# EAGLE design NixieClockControllerWemos (EAGLE 8.2.2)

## Sheet 1 of 2
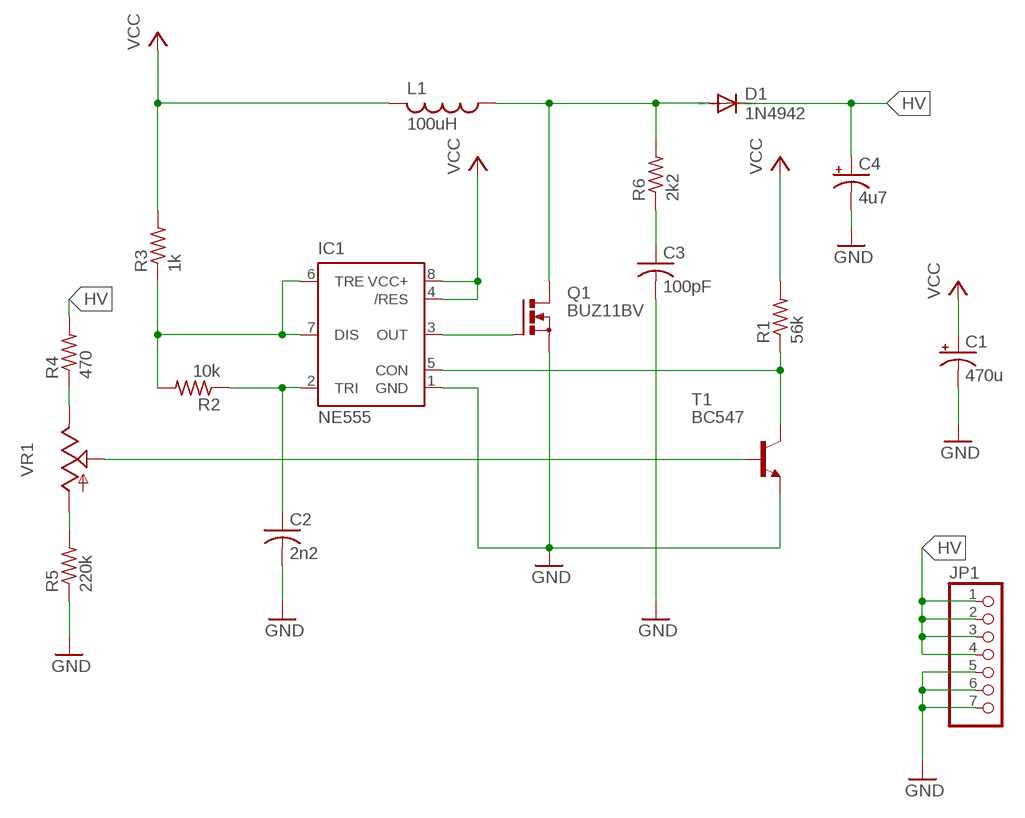
[diagram p0: schematic, sheet 1]

### Parts
C1  470u  CPOL-USE5-13  [E5-13]
C2  2n2  C-US050-025X075  [C050-025X075]
C3  100pF  C-US050-025X075  [C050-025X075]
C4  4u7  CPOL-USE3.5-8  [E3,5-8]
D1  1N4942  [DO41-10]
IC1  NE555  [DIL-08]
JP1  PINHD-1X7  [1X07]
L1  100uH  L-US  [RLB0914]
Q1  BUZ11BV  [TO220BV]
R1  56k  R-US_0207/10  [0207/10]
R2  10k  R-US_0207/10  [0207/10]
R3  1k  R-US_0207/10  [0207/10]
R4  470  R-US_0207/10  [0207/10]
R5  220k  R-US_0207/10  [0207/10]
R6  2k2  R-US_0207/10  [0207/10]
T1  BC547  [TO92]
VR1  TRIM_US-B25P  [B25P]

### Nets
GND: C1.- C2.2 C3.2 C4.- IC1.1(GND) JP1.5 JP1.6 JP1.7 Q1.S R5.1 T1.1(E) ; also sheet 2
HV: C4.+ D1.C JP1.1 JP1.2 JP1.3 JP1.4 R4.2
N$1: IC1.3(OUT) Q1.G
N$2: D1.A L1.1 Q1.D R6.2
N$3: IC1.6(TRE) IC1.7(DIS) R2.2 R3.1
N$4: R4.1 VR1.E
N$6: IC1.5(CON) R1.1 T1.3(C)
N$7: R5.2 VR1.A
N$8: T1.2(B) VR1.S
N$9: C3.1 R6.1
N$10: C2.1 IC1.2(TRI) R2.1
VCC: C1.+ IC1.4(/RES) IC1.8(VCC+) L1.2 R1.2 R3.2 ; also sheet 2

## Sheet 2 of 2
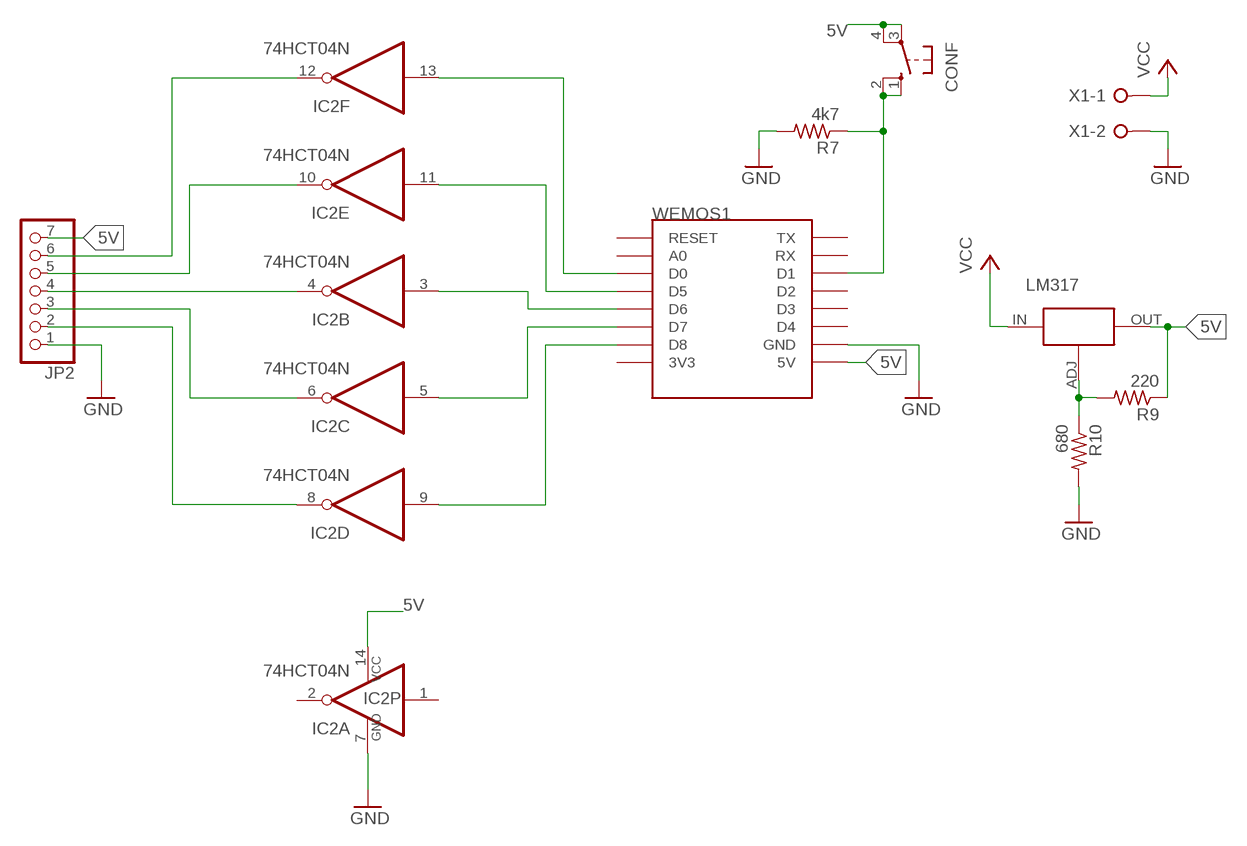
[diagram p1: schematic, sheet 2]

### Parts
CONF  10-XX  [B3F-10XX]
IC2  74HCT04N  [DIL14]
JP2  PINHD-1X7  [1X07]
R7  4k7  R-US_0207/10  [0207/10]
R9  220  R-US_0207/10  [0207/10]
R10  680  R-US_0207/10  [0207/10]
U$3  LM317-TO220  [LM317-TO220AV]
WEMOS1  WEMOS-D1-MINI  [WEMOS-D1-MINI]
X1  W237-02P  [W237-132]

### Nets
5V: CONF.3(P) CONF.4(P1) IC2.14(P:VCC) JP2.7 R9.1 U$3.OUT(VO) WEMOS1.5V
GND: IC2.7(P:GND) JP2.1 R7.2 R10.2 WEMOS1.GND X1.2 ; also sheet 1
N$5: IC2.12(F:O) JP2.6
N$11: IC2.10(E:O) JP2.5
N$12: R9.2 R10.1 U$3.ADJ
N$13: IC2.4(B:O) JP2.4
N$14: IC2.6(C:O) JP2.3
N$15: IC2.8(D:O) JP2.2
N$16: CONF.1(S) CONF.2(S1) R7.1 WEMOS1.D1
N$17: IC2.13(F:I) WEMOS1.D0
N$18: IC2.11(E:I) WEMOS1.D5
N$19: IC2.3(B:I) WEMOS1.D6
N$20: IC2.5(C:I) WEMOS1.D7
N$21: IC2.9(D:I) WEMOS1.D8
VCC: U$3.IN(VI) X1.1 ; also sheet 1
Unconnected: IC2.1(A:I) IC2.2(A:O) WEMOS1.3V3 WEMOS1.A0 WEMOS1.D2 WEMOS1.D3 WEMOS1.D4 WEMOS1.RESET WEMOS1.RX WEMOS1.TX

## Library data of the parts
C1 C4 = rcl:CPOL-US: POLARIZED CAPACITOR, American symbol
C2 C3 = rcl:C-US: CAPACITOR, American symbol
CONF = switch-omron:10-XX: OMRON SWITCH; MPN: B3F-1000; OC_FARNELL: 176432; OC_NEWARK: 36M3542
D1 = diode:1N4942: DIODE 1.0 A, 200 V, 150 ns
IC1 = st-microelectronics:NE555: General purpose bipolar Timer; MF: Arrow Electronics; MPN: NE555N; OC_FARNELL: 1467742; OC_NEWARK: 89K1486
IC2 = 74xx-eu:74*04: Hex INVERTER
JP1 JP2 = pinhead:PINHD-1X7: PIN HEADER
L1 = Inductors:L-US: INDUCTOR, American symbol
Q1 = transistor-power:BUZ11: N-CHANNEL MOS FET
R1-R7 R9 R10 = rcl:R-US_: RESISTOR, American symbol
T1 = transistor:BC547: NPN TRANSISTOR
U$3 = Regulators:LM317-TO220
VR1 = pot:TRIM_US-: POTENTIOMETER
WEMOS1 = esp8266modules:WEMOS-D1-MINI: WeMos.cc D1 mini ESP8266 module
X1 = con-wago-508:W237-02P: WAGO SREW CLAMP; OC_FARNELL: unknown; OC_NEWARK: unknown

## Board
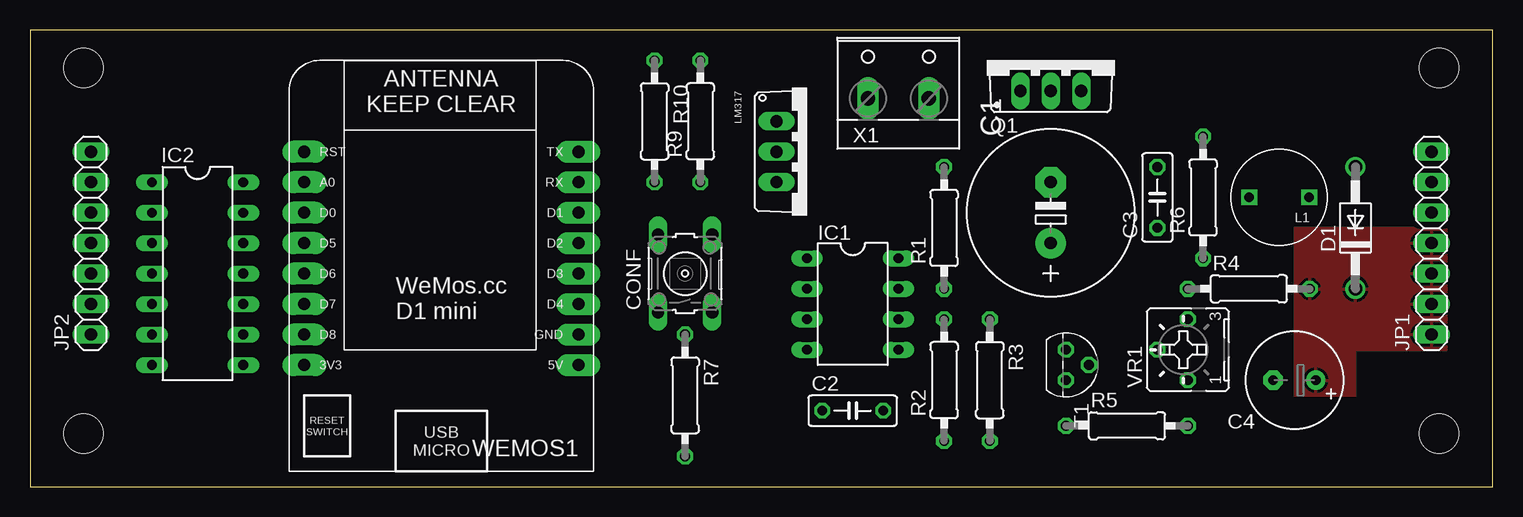
[diagram p2: board, top side]
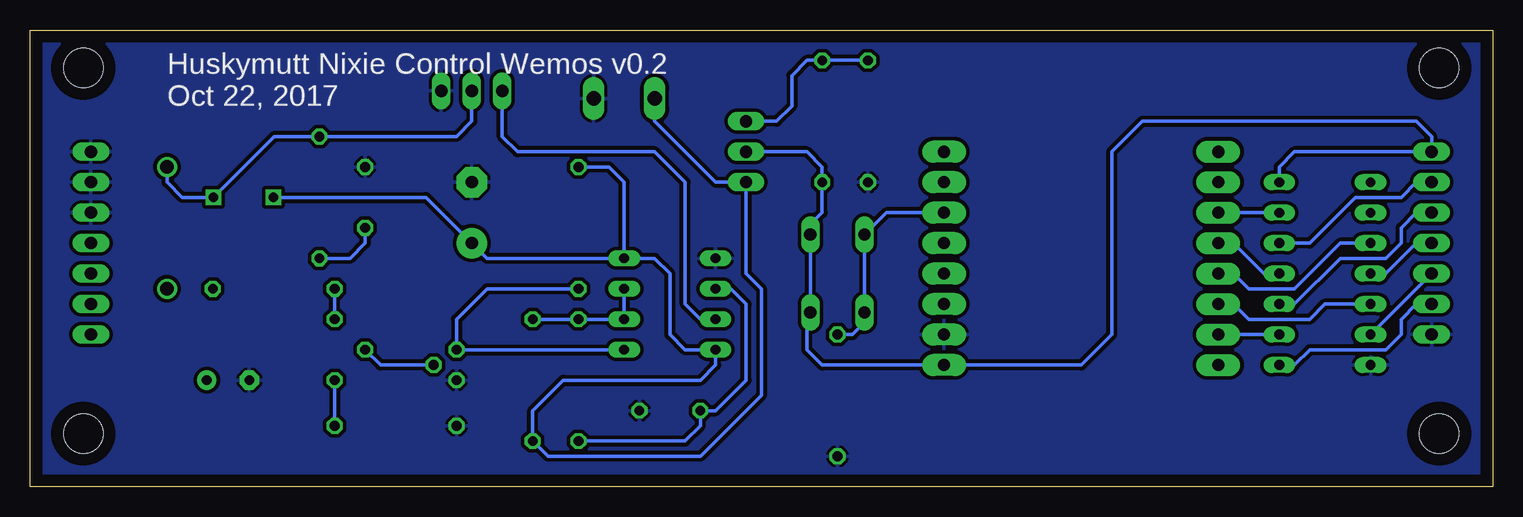
[diagram p3: board, bottom side, seen from below]

Size 121.92 x 38.1 mm. Coordinates in mm from the lower left corner, seen from the top.
Outline: 0,0 121.92,0 121.92,38.1 0,38.1 0,0
Copper layers (1*16): Top 0.035mm / dielectric 1.5mm / Bottom 0.035mm
Design rules "default": minimum track width 6mil, minimum drill 0.35mm, track to track 6mil, track to pad 6mil, pad to pad 6mil, via to via 6mil, smd to smd 6mil, copper to edge 40mil, drill to drill 6mil, minimum pad ring 10mil, minimum via ring 8mil, stop-mask expansion 4mil, vias tented up to drill 0mil, thermal gap 10mil
Holes 3.28 mm at 4.45,34.92 117.47,34.92 4.45,4.45 117.47,4.45

### Footprints (pad centres in the part's own frame; a part is rotated, then mirrored left to right if it is on the bottom)
E5-13 = drill 1.016 pad 2.54: + -2.54,0 | drill 1.016 pad 2.54 octagon: - 2.54,0
C050-025X075 = drill 0.813 octagon: 1 -2.54,0; 2 2.54,0
E3,5-8 = drill 0.813 pad 1.6: + -1.778,0 | drill 0.813 pad 1.6 octagon: - 1.778,0
B3F-10XX = drill 1.016 long: 1 -3.251,2.261; 2 3.251,2.261; 3 -3.251,-2.261; 4 3.251,-2.261
DO41-10 = drill 1.118: A 5.08,0; C -5.08,0
DIL-08 = drill 0.813 long: 1 -3.81,-3.81; 2 -1.27,-3.81; 3 1.27,-3.81; 4 3.81,-3.81; 5 3.81,3.81; 6 1.27,3.81; 7 -1.27,3.81; 8 -3.81,3.81
DIL14 = drill 0.813 long: 1 -7.62,-3.81; 2 -5.08,-3.81; 3 -2.54,-3.81; 4 0,-3.81; 5 2.54,-3.81; 6 5.08,-3.81; 7 7.62,-3.81; 8 7.62,3.81; 9 5.08,3.81; 10 2.54,3.81; 11 0,3.81; 12 -2.54,3.81; 13 -5.08,3.81; 14 -7.62,3.81
1X07 = drill 1.016 long: 1 -7.62,0; 2 -5.08,0; 3 -2.54,0; 4 0,0; 5 2.54,0; 6 5.08,0; 7 7.62,0
RLB0914 = drill 0.8 square: 1 -2.5,0; 2 2.5,0
TO220BV = drill 1.016 long: D 0,-2.54; G -2.54,-2.54; S 2.54,-2.54
0207/10 = drill 0.813 octagon: 1 -5.08,0; 2 5.08,0
TO92 = drill 0.813 octagon: 1 1.27,0; 2 0,1.905; 3 -1.27,0
LM317-TO220AV = drill 1.016 long: ADJ -2.54,-2.54; IN 2.54,-2.54; OUT 0,-2.54
B25P = drill 0.813 octagon: A -2.54,0; E 2.54,0; S 0,2.54
WEMOS-D1-MINI = drill 1.016 pad 1.829 long: 3V3 -10.16,-10.16; 5V 12.7,-10.16; A0 -10.16,5.08; D0 -10.16,2.54; D1 12.7,2.54; D2 12.7,0; D3 12.7,-2.54; D4 12.7,-5.08; D5 -10.16,0; D6 -10.16,-2.54; D7 -10.16,-5.08; D8 -10.16,-7.62; GND 12.7,-7.62; RESET -10.16,7.62; RX 12.7,5.08; TX 12.7,7.62
W237-132 = drill 1.194 long: 1 -2.54,-0.635; 2 2.54,-0.635

### Placement (x,y rotation side)
C1  85.09,22.86 90 top
C2  68.58,6.35 0 top
C3  93.98,24.13 90 top
C4  105.41,8.89 180 top
CONF  54.61,17.78 90 top
D1  110.49,21.59 90 top
IC1  68.58,15.24 270 top
IC2  13.97,17.78 270 top
JP1  116.84,20.32 90 top
JP2  5.08,20.32 90 top
L1  104.14,24.13 180 top
Q1  85.09,35.56 0 top
R1  76.2,21.59 90 top
R2  76.2,8.89 90 top
R3  80.01,8.89 270 top
R4  101.6,16.51 0 top
R5  91.44,5.08 0 top
R6  97.79,24.13 90 top
R7  54.61,7.62 270 top
R9  55.88,30.48 90 top
R10  52.07,30.48 270 top
T1  86.36,10.16 270 top
U$3  64.77,27.94 270 top
VR1  96.52,11.43 90 top
WEMOS1  33.02,20.32 0 top
X1  72.39,33.02 0 top

### Tracks (layer width: path | path; a pad name or v marks a point on that pad's centre or on a via)
5V
  Bottom 0.305: IC2.14 17.78,26.67 16.51,27.94 JP2.7 5.08,29.21 6.35,30.48 29.21,30.48 31.75,27.94 31.75,12.7 34.29,10.16 WEMOS1.5V 55.88,10.16 57.15,11.43 57.15,14.25 CONF.3 CONF.4 56.87,21.87 55.88,22.86 R9.1 55.88,26.67 57.15,27.94 U$3.OUT
GND
  pour Bottom (isolate 0.305): 0,0 121.92,0 121.92,38.1 0,38.1
HV
  pour Top (isolate 0.61): 105.41,21.59 105.41,7.62 110.49,7.62 110.49,11.43 118.11,11.43 118.11,21.59
N$1
  Bottom 0.305: IC1.3 66.04,13.97 67.31,15.24 67.31,25.4 69.85,27.94 81.28,27.94 82.55,29.21 Q1.G
N$2
  Bottom 0.305: 110.45,26.63 D1.A 110.49,25.4 109.22,24.13 L1.1 101.56,29.21 R6.2 86.36,29.21 85.09,30.48 Q1.D
N$3
  Bottom 0.305: IC1.7 IC1.6 R2.2 R3.1
N$4
  Bottom 0.305: VR1.E R4.1
N$5
  Bottom 0.305: JP2.6 6.35,25.4 7.62,24.13 11.43,24.13 15.24,20.32 IC2.12
N$6
  Bottom 0.305: IC1.5 T1.3 86.36,13.97 83.82,16.51 R1.1
N$7
  Bottom 0.305: VR1.A R5.2
N$8
  Bottom 0.305: T1.2 92.71,10.16 VR1.S
N$9
  Bottom 0.305: C3.1 93.98,20.32 95.25,19.05 R6.1
N$10
  Bottom 0.305: R2.1 67.31,3.81 66.04,5.08 C2.1 64.77,6.35 62.23,8.89 62.23,15.24 63.5,16.51 IC1.2
N$11
  Bottom 0.305: IC2.10 16.51,15.24 12.7,19.05 8.89,19.05 7.62,20.32 7.62,21.59 6.35,22.86 JP2.5
N$12
  Bottom 0.305: R10.1 R9.2 57.15,35.56 58.42,34.29 58.42,31.75 59.69,30.48 U$3.ADJ
N$13
  Bottom 0.305: JP2.4 6.35,20.32 8.89,17.78 IC2.4
N$14
  Bottom 0.305: IC2.6 JP2.3
N$15
  Bottom 0.305: JP2.2 6.35,15.24 7.62,13.97 7.62,12.7 8.89,11.43 15.24,11.43 16.51,10.16 IC2.8
N$16
  Bottom 0.305: R7.1 53.34,12.7 52.07,13.97 52.07,14.25 CONF.1 CONF.2 50.52,22.86 WEMOS1.D1
N$17
  Bottom 0.305: IC2.13 WEMOS1.D0
N$18
  Bottom 0.305: IC2.11 19.05,17.78 21.59,20.32 WEMOS1.D5
N$19
  Bottom 0.305: WEMOS1.D6 21.59,17.78 20.32,16.51 16.51,16.51 12.7,20.32 IC2.3
N$20
  Bottom 0.305: IC2.5 13.97,15.24 15.24,13.97 20.32,13.97 21.59,15.24 WEMOS1.D7
N$21
  Bottom 0.305: IC2.9 WEMOS1.D8
VCC
  Bottom 0.305: 64.89,11.43 IC1.4 | 64.89,11.43 67.31,11.43 68.58,12.7 68.58,17.78 69.85,19.05 IC1.8 | 64.89,11.43 64.77,11.31 64.77,10.16 66.04,8.89 77.47,8.89 80.01,6.35 R3.2 78.74,2.54 66.04,2.54 60.96,7.62 60.96,16.51 62.23,17.78 U$3.IN 64.77,25.4 69.85,30.48 X1.1 | IC1.8 72.39,25.4 73.66,26.67 R1.2 | IC1.8 83.82,19.05 C1.+ 88.9,24.13 L1.2

### Text on the board
bPlace: Huskymutt Nixie Control Wemos v0.2 / Oct 22, 2017